# EAGLE board sc (EAGLE 7.7.0)
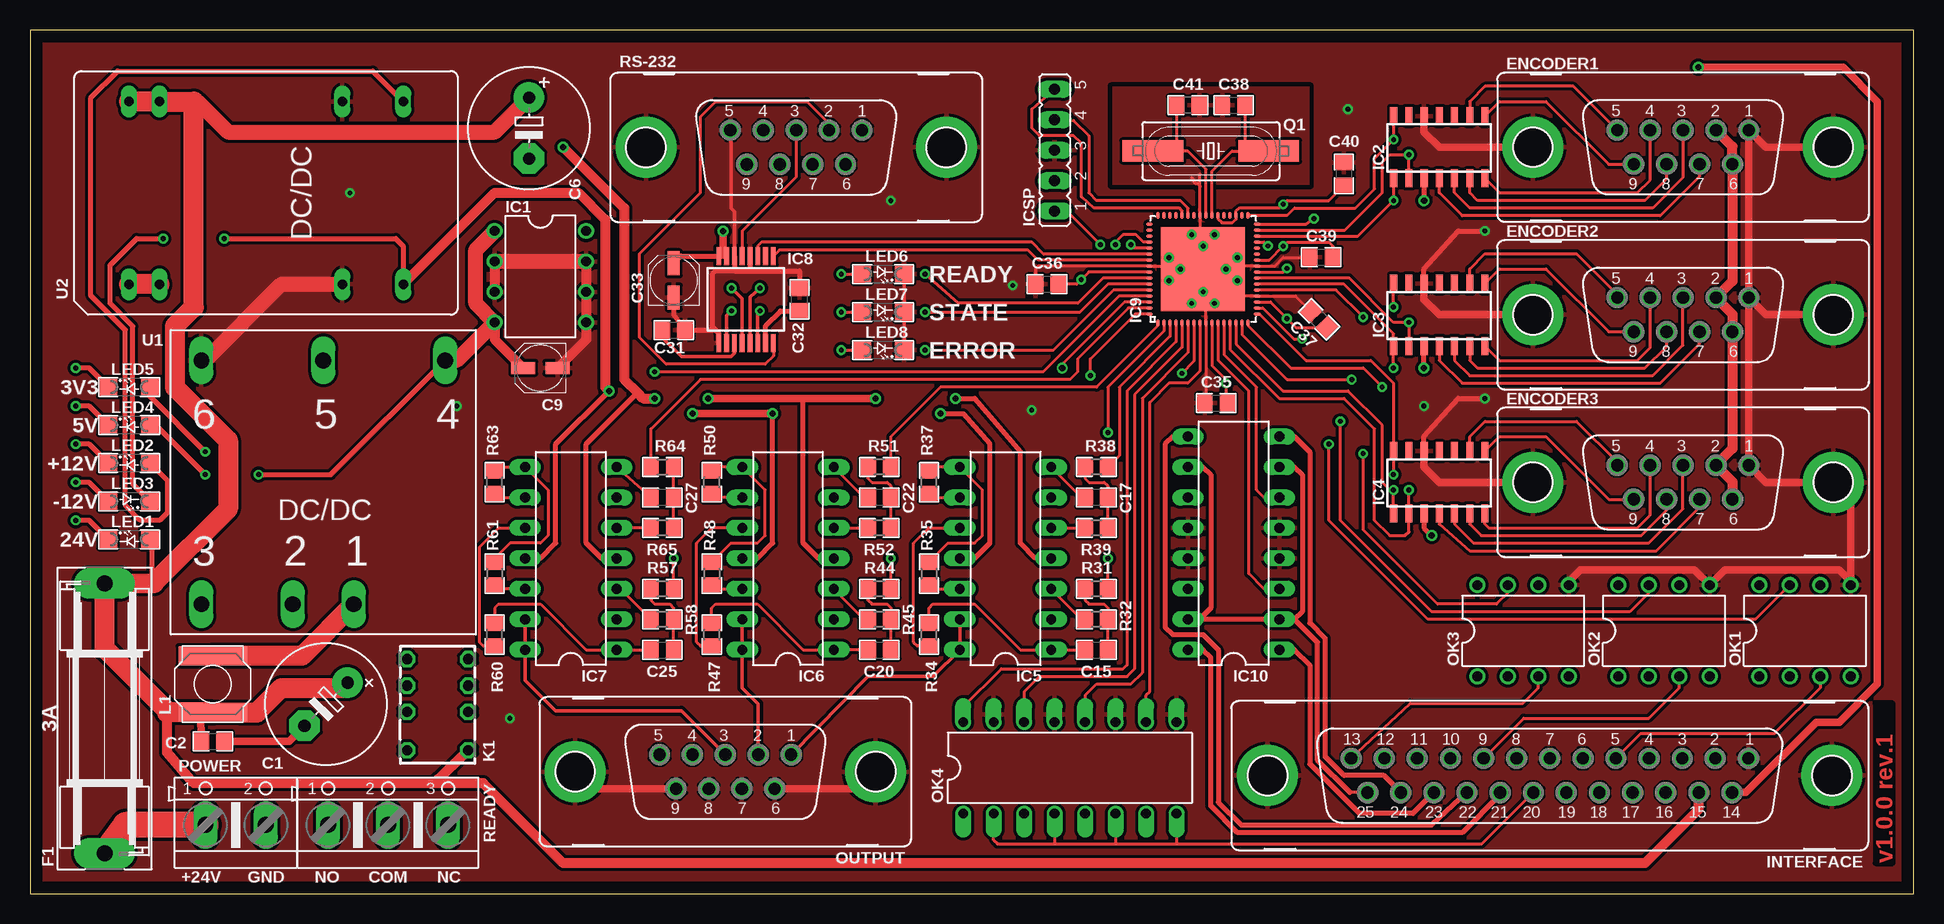
[diagram p7: board, top side]
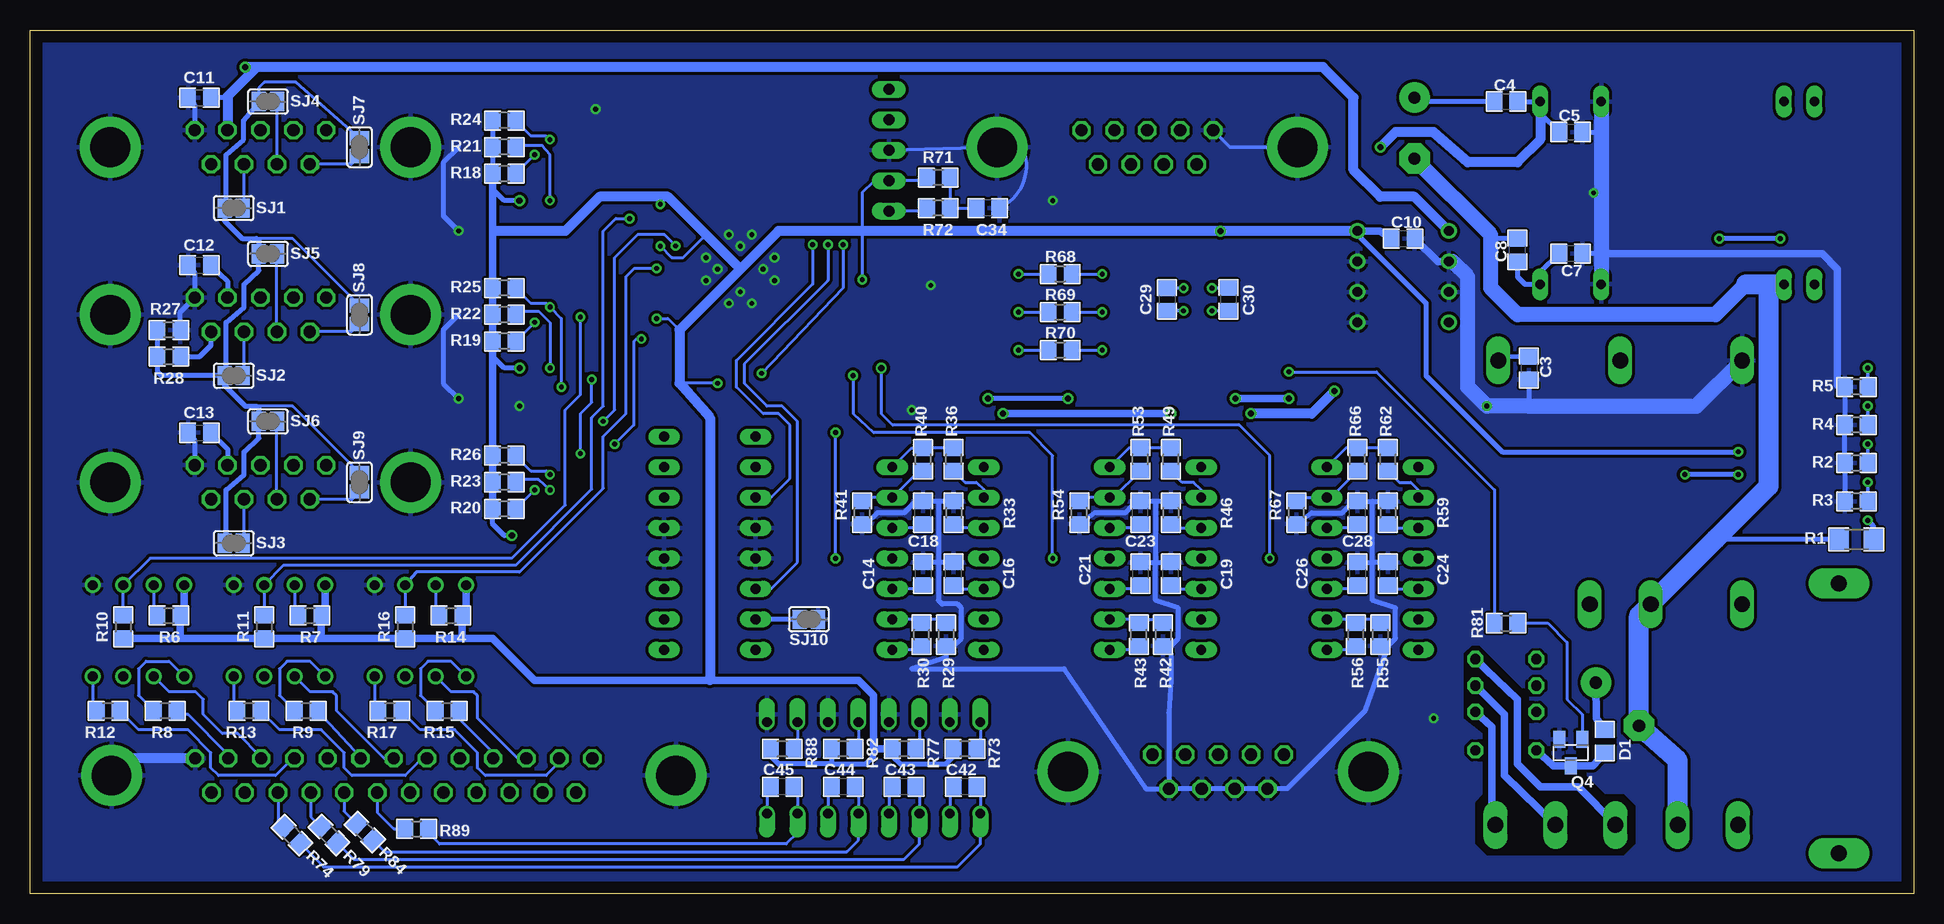
[diagram p8: board, bottom side, seen from below]

Size 157 x 72 mm. Coordinates in mm from the lower left corner, seen from the top.
Outline: 0,0 157,0 157,72 0,72 0,0
Copper layers (1*16): Top 0.035mm / dielectric 1.5mm / Bottom 0.035mm
Design rules "default *": minimum track width 0.15mm, minimum drill 0.4mm, track to track 0.2mm, track to pad 0.2mm, pad to pad 0.2mm, via to via 0.2mm, smd to smd 0.2mm, copper to edge 40mil, drill to drill 8mil, minimum pad ring 10mil, minimum via ring 8mil, stop-mask expansion 4mil, vias tented up to drill 0mil, thermal gap 10mil
Net classes: 0 default: clearance 0.205 mm
tKeepout: area 0,0 to 2,72; area 155,0 to 157,72; area 0,70 to 157,72; area 0,0 to 157,2

## Footprints (pad centres in the part's own frame; a part is rotated, then mirrored left to right if it is on the bottom)
E5-10,5 = drill 1.016 pad 2.54: + -2.54,0 | drill 1.016 pad 2.54 octagon: - 2.54,0
C0805 = smd 1.3 x 1.5: 1 -0.95,0; 2 0.95,0
UD-4X5,8_NICHICON = smd 2 x 1: + 1.425,0; - -1.425,0
D0805 = smd 1.3 x 1.5: 1 -0.95,0; 2 0.95,0
F09VP = drill 1.016 octagon: 1 5.486,1.422; 2 2.743,1.422; 3 0,1.422; 4 -2.743,1.422; 5 -5.486,1.422; 6 4.115,-1.422; 7 1.372,-1.422; 8 -1.372,-1.422; 9 -4.115,-1.422 | drill 3.302 pad 5.08: G1 -12.522,0; G2 12.522,0
SH22,5 = drill 1.321 pad 2.54 long: 1 -11.252,0; 2 11.252,0
DIL08 = drill 0.813 pad 1.27: 1 -3.81,-3.81; 2 -1.27,-3.81; 3 1.27,-3.81; 4 3.81,-3.81; 5 3.81,3.81; 6 1.27,3.81; 7 -1.27,3.81; 8 -3.81,3.81
SO14 = smd 0.6 x 1.5: 1 -3.81,-2.6; 2 -2.54,-2.6; 3 -1.27,-2.6; 4 0,-2.6; 5 1.27,-2.6; 6 2.54,-2.6; 7 3.81,-2.6; 8 3.81,2.6; 9 2.54,2.6; 10 1.27,2.6; 11 0,2.6; 12 -1.27,2.6; 13 -2.54,2.6; 14 -3.81,2.6
DIL14 = drill 0.813 long: 1 -7.62,-3.81; 2 -5.08,-3.81; 3 -2.54,-3.81; 4 0,-3.81; 5 2.54,-3.81; 6 5.08,-3.81; 7 7.62,-3.81; 8 7.62,3.81; 9 5.08,3.81; 10 2.54,3.81; 11 0,3.81; 12 -2.54,3.81; 13 -5.08,3.81; 14 -7.62,3.81
SSOP16 = smd 0.4 x 1.5: 1 -2.275,-3.625; 2 -1.625,-3.625; 3 -0.975,-3.625; 4 -0.325,-3.625; 5 0.325,-3.625; 6 0.975,-3.625; 7 1.625,-3.625; 8 2.275,-3.625; 9 2.275,3.625; 10 1.625,3.625; 11 0.975,3.625; 12 0.325,3.625; 13 -0.325,3.625; 14 -0.975,3.625; 15 -1.625,3.625; 16 -2.275,3.625
QFN64-9X9 = smd 0.55 x 0.28: 1 -4.477,3.75; 2 -4.477,3.25; 3 -4.477,2.75; 4 -4.477,2.25; 5 -4.477,1.75; 6 -4.477,1.25; 7 -4.477,0.75; 8 -4.477,0.25; 9 -4.477,-0.25; 10 -4.477,-0.75; 11 -4.477,-1.25; 12 -4.477,-1.75; 13 -4.477,-2.25; 14 -4.477,-2.75; 15 -4.477,-3.25; 16 -4.477,-3.75; 33 4.477,-3.75; 34 4.477,-3.25; 35 4.477,-2.75; 36 4.477,-2.25; 37 4.477,-1.75; 38 4.477,-1.25; 39 4.477,-0.75; 40 4.477,-0.25; 41 4.477,0.25; 42 4.477,0.75; 43 4.477,1.25; 44 4.477,1.75; 45 4.477,2.25; 46 4.477,2.75; 47 4.477,3.25; 48 4.477,3.75 | smd 0.28 x 0.55: 17 -3.75,-4.477; 18 -3.25,-4.477; 19 -2.75,-4.477; 20 -2.25,-4.477; 21 -1.75,-4.477; 22 -1.25,-4.477; 23 -0.75,-4.477; 24 -0.25,-4.477; 25 0.25,-4.477; 26 0.75,-4.477; 27 1.25,-4.477; 28 1.75,-4.477; 29 2.25,-4.477; 30 2.75,-4.477; 31 3.25,-4.477; 32 3.75,-4.477; 49 3.75,4.477; 50 3.25,4.477; 51 2.75,4.477; 52 2.25,4.477; 53 1.75,4.477; 54 1.25,4.477; 55 0.75,4.477; 56 0.25,4.477; 57 -0.25,4.477; 58 -0.75,4.477; 59 -1.25,4.477; 60 -1.75,4.477; 61 -2.25,4.477; 62 -2.75,4.477; 63 -3.25,4.477; 64 -3.75,4.477 | smd 7 x 7: EXP 0,0
DIL16 = drill 0.813 long: 1 -8.89,-3.81; 2 -6.35,-3.81; 3 -3.81,-3.81; 4 -1.27,-3.81; 5 1.27,-3.81; 6 3.81,-3.81; 7 6.35,-3.81; 8 8.89,-3.81; 9 8.89,3.81; 10 6.35,3.81; 11 3.81,3.81; 12 1.27,3.81; 13 -1.27,3.81; 14 -3.81,3.81; 15 -6.35,3.81; 16 -8.89,3.81
JP5 = drill 0.914 long: 1 -3.81,0; 2 -1.27,0; 3 1.27,0; 4 3.81,0; 5 6.35,0
F25VP = drill 1.016 octagon: 1 16.561,1.422; 2 13.792,1.422; 3 11.049,1.422; 4 8.28,1.422; 5 5.512,1.422; 6 2.769,1.422; 7 0,1.422; 8 -2.769,1.422; 9 -5.512,1.422; 10 -8.28,1.422; 11 -11.049,1.422; 12 -13.792,1.422; 13 -16.561,1.422; 14 15.189,-1.422; 15 12.421,-1.422; 16 9.652,-1.422; 17 6.909,-1.422; 18 4.14,-1.422; 19 1.372,-1.422; 20 -1.372,-1.422; 21 -4.14,-1.422; 22 -6.909,-1.422; 23 -9.652,-1.422; 24 -12.421,-1.422; 25 -15.189,-1.422 | drill 3.302 pad 5.08: G1 -23.52,0; G2 23.52,0
G6K-2P-Y = drill 0.85 octagon: 1 0,-2.54; 2 3.2,-2.54; 3 5.4,-2.54; 4 7.6,-2.54; 5 7.6,2.54; 6 5.4,2.54; 7 3.2,2.54; 8 0,2.54
DJNR6028 = smd 1.6 x 5.69: A -2.362,0; B 2.362,0
SML1206 = smd 1.5 x 1.5: A 1.75,0; C -1.75,0
DIL16' = drill 0.813 offset: 1 -8.89,-3.81; 2 -6.35,-3.81; 3 -3.81,-3.81; 4 -1.27,-3.81; 5 1.27,-3.81; 6 3.81,-3.81; 7 6.35,-3.81; 8 8.89,-3.81; 9 8.89,3.81; 10 6.35,3.81; 11 3.81,3.81; 12 1.27,3.81; 13 -1.27,3.81; 14 -3.81,3.81; 15 -6.35,3.81; 16 -8.89,3.81
AK500/2 = drill 1.321 long: 1 -2.515,0; 2 2.515,0
SM49 = smd 5.08 x 1.778: 1 -4.826,0; 2 4.826,0
SOT23 = smd 1 x 1.4: 1 -0.95,-1.1; 2 0.95,-1.1; 3 0,1.1
R1206 = smd 1.6 x 1.803: 1 -1.422,0; 2 1.422,0
R0805 = smd 1.3 x 1.5: 1 -0.95,0; 2 0.95,0
AK500/3 = drill 1.321 long: 1 -5.004,0; 2 0,0; 3 5.004,0
SJ = smd 1.168 x 1.6: 1 -0.762,0; 2 0.762,0
AM10CW-NZ = drill 1.321 long: 1 2.54,-10.16; 2 -2.54,-10.16; 3 -10.16,-10.16; 4 10.16,10.16; 5 0,10.16; 6 -10.16,10.16
TEN3-WIN = drill 0.813 long: 2 -7.62,11.43; 3 -7.62,8.89; 9 -7.62,-6.35; 11 -7.62,-11.43; 14 7.62,-11.43; 16 7.62,-6.35; 22 7.62,8.89; 23 7.62,11.43

## Placement (x,y rotation side)
C1  330uF  [E5-10,5]  24.67,15.78 225 top
C2  1uF  [C0805]  15.24,12.7 0 top
C3  10uF  [C0805]  32.07,43.81 270 bottom
C4  1nF/2KV  [C0805]  33.97,66.04 0 bottom
C5  470uF  [C0805]  28.57,63.5 0 bottom
C6  200uF  [E5-10,5]  41.59,63.82 270 top
C7  470uF  [C0805]  28.57,53.34 180 bottom
C8  1nF/2KV  [C0805]  33.02,53.66 90 bottom
C9  10uF  [UD-4X5,8_NICHICON]  42.55,43.81 180 top
C10  10uF  [C0805]  42.55,54.61 0 bottom
C11  10uF  [C0805]  142.88,66.36 0 bottom
C12  10uF  [C0805]  142.88,52.39 0 bottom
C13  10uF  [C0805]  142.88,38.42 0 bottom
C14  33n  [C0805]  82.55,26.67 270 bottom
C15  10n  [C0805]  88.9,20.32 0 top
C16  33n  [C0805]  80.01,26.67 90 bottom
C17  10n  [C0805]  88.9,33.02 180 top
C18  33n  [C0805]  82.55,31.75 90 bottom
C19  33n  [C0805]  64.45,26.67 270 bottom
C20  10n  [C0805]  70.8,20.32 0 top
C21  33n  [C0805]  61.91,26.67 90 bottom
C22  10n  [C0805]  70.8,33.02 180 top
C23  33n  [C0805]  64.45,31.75 90 bottom
C24  33n  [C0805]  46.35,26.67 270 bottom
C25  10n  [C0805]  52.7,20.32 0 top
C26  33n  [C0805]  43.81,26.67 90 bottom
C27  10n  [C0805]  52.7,33.02 180 top
C28  33n  [C0805]  46.35,31.75 90 bottom
C29  100n  [C0805]  62.23,49.53 270 bottom
C30  100n  [C0805]  57.09,49.54 90 bottom
C31  100n  [C0805]  53.66,46.99 0 top
C32  100n  [C0805]  64.14,49.53 90 top
C33  100n  [UD-4X5,8_NICHICON]  53.66,51.12 90 top
C34  100n  [C0805]  77.15,57.15 180 bottom
C35  100n  [C0805]  98.87,40.89 0 top
C36  100n  [C0805]  84.77,50.8 0 top
C37  100n  [C0805]  107.44,47.88 135 top
C38  27p  [C0805]  100.33,65.72 0 top
C39  100n  [C0805]  107.63,53.07 0 top
C40  100n  [C0805]  109.54,60.01 90 top
C41  27p  [C0805]  96.52,65.72 180 top
C42  100n  [C0805]  79.05,8.89 180 bottom
C43  100n  [C0805]  84.14,8.89 180 bottom
C44  100n  [C0805]  89.21,8.89 180 bottom
C45  100n  [C0805]  94.3,8.89 180 bottom
D1  1N4148SMD-0805  [D0805]  25.72,12.7 90 bottom
ENCODER1  [F09VP]  137.79,62.23 0 top
ENCODER2  [F09VP]  137.79,48.26 0 top
ENCODER3  [F09VP]  137.79,34.29 0 top
F1  3A  [SH22,5]  6.22,14.61 90 top
IC1  MAX604  [DIL08]  42.55,51.44 270 top
IC2  LM339D  [SO14]  117.47,62.23 0 top
IC3  LM339D  [SO14]  117.47,48.26 0 top
IC4  LM339D  [SO14]  117.47,34.29 0 top
IC5  LM324N  [DIL14]  81.31,27.94 90 top
IC6  LM324N  [DIL14]  63.18,27.94 90 top
IC7  LM324N  [DIL14]  45.09,27.94 90 top
IC8  MAX3221CAE  [SSOP16]  59.69,49.53 0 top
IC9  PIC32  [QFN64-9X9]  97.79,52.07 90 top
IC10  ULN2074BN  [DIL16]  100.33,29.21 90 top
ICSP  ICSP  [JP5]  85.41,60.71 90 top
INTERFACE  [F25VP]  126.68,9.84 0 top
K1  G6K-2P-Y  [G6K-2P-Y]  33.97,11.94 90 top
L1  4,7uH  [DJNR6028]  15.24,17.46 90 top
LED1  LED 24V  [SML1206]  8.26,29.53 0 top
LED2  LED +12V  [SML1206]  8.26,35.88 0 top
LED3  LED -12V  [SML1206]  8.26,32.7 180 top
LED4  LED 5V  [SML1206]  8.26,39.05 0 top
LED5  LED 3V3  [SML1206]  8.26,42.23 0 top
LED6  LED READY  [SML1206]  71.12,51.66 180 top
LED7  LED STATE  [SML1206]  71.12,48.48 180 top
LED8  LED ERROR  [SML1206]  71.12,45.31 180 top
OK1  TLP2662F  [DIL08]  147.95,21.91 0 top
OK2  TLP2662F  [DIL08]  136.2,21.91 0 top
OK3  TLP2662F  [DIL08]  124.46,21.91 0 top
OK4  LTV844  [DIL16']  86.67,10.48 0 top
OUTPUT  [F09VP]  57.96,10.16 0 top
POWER  12/24V_CON  [AK500/2]  17.14,5.71 0 top
Q1  20MHz 18pF  [SM49]  98.42,61.91 0 top
Q4  BC848SMD  [SOT23]  28.57,11.75 180 bottom
R1  2K2  [R1206]  4.76,29.53 180 bottom
R2  470  [R0805]  4.76,35.88 180 bottom
R3  470  [R0805]  4.76,32.7 180 bottom
R4  130  [R0805]  4.76,39.05 180 bottom
R5  100  [R0805]  4.76,42.23 180 bottom
R6  4K7  [R0805]  145.41,23.18 0 bottom
R7  4K7  [R0805]  133.66,23.18 0 bottom
R8  470  [R0805]  145.73,15.24 180 bottom
R9  470  [R0805]  133.98,15.24 180 bottom
R10  4K7  [R0805]  149.22,22.23 270 bottom
R11  4K7  [R0805]  137.47,22.23 270 bottom
R12  470  [R0805]  150.49,15.24 180 bottom
R13  470  [R0805]  138.74,15.24 180 bottom
R14  4K7  [R0805]  121.92,23.18 0 bottom
R15  470  [R0805]  122.23,15.24 180 bottom
R16  4K7  [R0805]  125.73,22.23 270 bottom
R17  470  [R0805]  127,15.24 180 bottom
R18  4K7  [R0805]  117.47,60.01 180 bottom
R19  4K7  [R0805]  117.47,46.04 180 bottom
R20  4K7  [R0805]  117.47,32.07 180 bottom
R21  4K7  [R0805]  117.47,62.23 180 bottom
R22  4K7  [R0805]  117.47,48.26 180 bottom
R23  4K7  [R0805]  117.47,34.29 180 bottom
R24  4K7  [R0805]  117.47,64.45 180 bottom
R25  4K7  [R0805]  117.47,50.48 180 bottom
R26  4K7  [R0805]  117.47,36.51 180 bottom
R27  330  [R0805]  145.41,44.77 0 bottom
R28  1K  [R0805]  145.41,46.99 180 bottom
R29  47K  [R0805]  80.64,21.59 270 bottom
R30  22K  [R0805]  82.68,21.59 90 bottom
R31  22K  [R0805]  88.9,25.4 180 top
R32  10K  [R0805]  88.9,22.86 180 top
R33  47K  [R0805]  80.01,31.75 270 bottom
R34  22K  [R0805]  74.93,21.59 90 top
R35  22K  [R0805]  74.93,26.67 270 top
R36  22K  [R0805]  80.01,36.2 90 bottom
R37  47K  [R0805]  74.93,34.29 90 top
R38  22K  [R0805]  88.9,35.56 180 top
R39  10K  [R0805]  88.9,30.48 180 top
R40  22K  [R0805]  82.55,36.2 90 bottom
R41  47K  [R0805]  87.63,31.75 90 bottom
R42  47K  [R0805]  62.55,21.59 270 bottom
R43  22K  [R0805]  64.58,21.59 90 bottom
R44  22K  [R0805]  70.8,25.4 180 top
R45  10K  [R0805]  70.8,22.86 180 top
R46  47K  [R0805]  61.91,31.75 270 bottom
R47  22K  [R0805]  56.83,21.59 90 top
R48  22K  [R0805]  56.83,26.67 270 top
R49  22K  [R0805]  61.91,36.2 90 bottom
R50  47K  [R0805]  56.83,34.29 90 top
R51  22K  [R0805]  70.8,35.56 180 top
R52  10K  [R0805]  70.8,30.48 180 top
R53  22K  [R0805]  64.45,36.2 90 bottom
R54  47K  [R0805]  69.53,31.75 90 bottom
R55  47K  [R0805]  44.45,21.59 270 bottom
R56  22K  [R0805]  46.48,21.59 90 bottom
R57  22K  [R0805]  52.7,25.4 180 top
R58  10K  [R0805]  52.7,22.86 180 top
R59  47K  [R0805]  43.81,31.75 270 bottom
R60  22K  [R0805]  38.73,21.59 90 top
R61  22K  [R0805]  38.73,26.67 270 top
R62  22K  [R0805]  43.81,36.2 90 bottom
R63  47K  [R0805]  38.73,34.29 90 top
R64  22K  [R0805]  52.7,35.56 0 top
R65  10K  [R0805]  52.7,30.48 180 top
R66  22K  [R0805]  46.35,36.2 90 bottom
R67  47K  [R0805]  51.44,31.75 90 bottom
R68  100  [R0805]  71.12,51.66 0 bottom
R69  100  [R0805]  71.12,48.48 0 bottom
R70  100  [R0805]  71.12,45.31 0 bottom
R71  10K  [R0805]  81.28,59.69 180 bottom
R72  1K  [R0805]  81.28,57.15 180 bottom
R73  4K7  [R0805]  79.06,12.06 180 bottom
R74  1K  [R0805]  135.16,4.86 315 bottom
R77  4K7  [R0805]  84.13,12.06 180 bottom
R79  1K  [R0805]  132.08,4.89 315 bottom
R81  4K7  [R0805]  33.97,22.54 0 bottom
R82  4K7  [R0805]  89.22,12.06 180 bottom
R84  1K  [R0805]  129.09,5.13 315 bottom
R88  4K7  [R0805]  94.29,12.06 180 bottom
R89  1K  [R0805]  124.77,5.4 0 bottom
READY  READY  [AK500/3]  29.84,5.71 0 top
RS-232  [F09VP]  63.87,62.22 0 top
SJ1  [SJ]  140.01,57.15 0 bottom
SJ2  [SJ]  140.01,43.18 0 bottom
SJ3  [SJ]  140.01,29.21 0 bottom
SJ4  [SJ]  137.16,66.04 0 bottom
SJ5  [SJ]  137.16,53.34 0 bottom
SJ6  [SJ]  137.16,39.37 0 bottom
SJ7  [SJ]  129.54,62.23 270 bottom
SJ8  [SJ]  129.54,48.26 270 bottom
SJ9  [SJ]  129.54,34.29 270 bottom
SJ10  [SJ]  92.08,22.86 180 bottom
U1  AM10CW-2405S-NZ  [AM10CW-NZ]  24.45,34.29 0 top
U2  TEN3-2422WIN  [TEN3-WIN]  19.68,58.42 90 top

## Tracks (layer width: path | path; a pad name or v marks a point on that pad's centre or on a via)
2V5
  Bottom 0.254: SJ7.1 134.81,67.63 137.47,67.63 137.92,67.18 SJ4.1 | SJ8.1 135.12,54.61 138.11,54.61 137.92,54.48 | SJ9.1 135.12,40.64 138.11,40.64 137.92,40.51
  Bottom 0.406: SJ4.1 137.92,65.91 139.19,64.45 139.19,62.87 140.65,61.59 140.65,57.28 SJ1.1 140.78,56.07 139.31,54.61 138.11,54.61 | 137.92,54.48 SJ5.1 137.92,51.94 139.16,50.8 139.16,48.9 140.65,47.62 140.65,43.31 SJ2.1 | 137.92,40.51 SJ6.1 137.92,37.97 139.16,36.83 139.16,34.92 140.65,33.66 140.65,29.34 SJ3.1 | R28.2 R27.1 146.36,43.49 146.05,43.18 SJ2.1 | SJ2.1 140.78,42.35 139.06,40.64 138.11,40.64
3V3  (via drill 0.41, 0.51)
  Top 0.254: IC9.19 103.4,49.32 v104.78,47.94 105.51,47.21 C37.1 | IC9.10 98.54,44.02 99.69,42.86 v99.69,42.55 99.69,41.52 C35.2 | IC9.26 103.3,52.82 v104.46,53.98 104.78,54.29 108.27,54.29 108.58,53.98 C39.2 | 99.06,56.57 IC9.38 99.04,56.22 99.34,55.94 100.23,55.94 100.54,56.22 IC9.35 100.54,56.9 100.86,57.17 104.17,57.17 v104.46,57.47 104.78,57.78 108.27,57.78 C40.1 | IC9.57 88.27,51.82 v87.63,51.19 87.25,50.8 C36.2
  Top 0.305: 57.78,53.34 57.41,53.66 IC8.16
  Top 0.406: IC8.15 IC8.16 54.27,53.16 C33.+ | v116.2,43.81 IC3.3 | LED5.A 10.01,41.43 v14.61,36.83 | IC2.3 v116.2,57.78 | IC4.3 116.2,30.48 v116.84,29.84
  Top 0.61: v57.78,55.24 57.78,53.34 | IC2.3
  Bottom 0.254: v87.63,51.19 87.63,55.24 87.63,58.42 86.61,59.44 ICSP.2 82.48,59.44 R71.2 | v104.46,53.98 103.5,53.02 102.55,53.02 100.65,54.93 | v99.69,42.55 102.87,42.55 | v104.78,47.94 103.82,47.94 102.87,46.99 | v104.46,57.47 103.82,58.1
  Bottom 0.406: R24.2 R21.2 R18.2 | v116.84,29.84 117.47,29.84 118.42,30.8 R20.2 | v116.2,43.81 117.47,43.81 118.42,44.77 R19.2 | 90.17,10.79 94.61,10.79 95.24,11.43 R88.2 | R77.2 85.08,11.43 84.45,10.79 80.64,10.79 80.01,11.43 R73.2 | 144.14,23.5 R6.2 144.14,22.86 | 132.39,23.5 R7.2 | R14.2 | IC1.8 46.35,54.93 40.64,49.21 40.64,43.18 34.29,36.83 v14.61,36.83 | v116.2,57.78 117.47,57.78 118.42,58.73 | 118.11,55.24 118.42,55.24 | R82.2 90.17,10.79 | 90.17,10.79 87.31,10.79 86.68,11.43 86.68,12.06
  Bottom 0.61: R77.2 86.68,12.06 86.68,16.51 87.95,17.78 100.33,17.78 114.94,17.78 118.43,21.27 120.97,21.27 | IC1.8 44.5,55.24 C10.1 | R20.2 R23.2 R26.2 R19.2 R22.2 R25.2 118.42,55.24 118.42,58.73 R18.2 | OK1.8 144.14,23.5 | OK2.8 132.39,23.5 | OK3.8 120.65,23.5 | 120.65,23.5 R14.2 | 144.46,21.27 R11.2 132.71,21.27 | 144.46,21.27 R10.2 | 132.71,21.27 R16.2 120.97,21.27 | R6.2 144.46,21.27 | R7.2 132.71,21.27 | 120.65,23.5 arc-90 R14.2 120.97,21.27
  Bottom 0.813: IC1.8 v57.78,55.24 87.63,55.24 94.61,55.24 97.79,52.07 | 97.79,52.07 102.87,46.99 102.87,42.55 100.33,39.69 100.33,17.78 | 97.79,52.07 100.65,54.93 103.82,58.1 109.54,58.1 112.39,55.24 118.11,55.24
5V  (via drill 0.41, 0.51)
  Top 0.406: LED4.A 10.48,39.05 v14.61,34.92 | v19.05,34.92 25.08,34.92 U1.4
  Top 0.61: v139.06,68.9 151.13,68.9 153.99,66.04 153.99,17.46 150.81,14.29 148.91,14.29 143.04,8.42 INTERFACE.14
  Top 0.813: IC1.4 38.73,46.2 C9.+ | ENCODER1.2 141.91,62.28 ENCODER1.6 141.91,51.05 ENCODER2.2 141.91,48.31 ENCODER2.6 141.91,37.08 ENCODER3.2 141.91,34.34 ENCODER3.6
  Top 1.27: IC1.1 37.15,53.66 37.15,49.21 IC1.4 35.56,44.45 U1.4
  Bottom 0.406: R27.2 142.86,44.77 141.91,45.72 ENCODER2.6 | U1.4 34.24,44.81 C3.1 | v14.61,34.92 v19.05,34.92 | 140.53,66.48 140.65,66.36 C11.2 | C12.2 140.53,51.05 ENCODER2.2 | C13.2 140.53,37.08 ENCODER3.2
  Bottom 0.813: IC1.1 41.59,58.1 44.45,58.1 46.67,60.33 46.67,66.36 49.21,68.9 138.11,68.9 | 138.11,68.9 140.53,66.48 ENCODER1.2 | 138.11,68.9 v139.06,68.9
24V
  Top 2.184: POWER.1 7.96,5.71 F1.1
24V_F
  Top 0.406: 10.16,29.38 10.16,25.88
  Top 0.61: C2.1 14.24,15.05 L1.A | LED1.A 10.16,29.38
  Top 0.813: K1.1 33.66,9.21 | 33.66,9.21 13.65,9.21 11.43,11.75 11.43,15.23 | 33.66,9.21 37.78,9.21 44.45,2.54 134.62,2.54 139.1,7.02 INTERFACE.15
  Top 1.27: L1.A 17.64,15.1 | 13.65,66.04 13.97,66.04 16.51,63.5 38.73,63.5 C6.+
  Top 1.676: U2.23 U2.22 13.65,66.04 13.65,48.9 12.06,47.31 12.06,42.23 16.51,37.78 16.51,32.07 10.32,25.88 10.16,25.88 F1.2 6.22,20.44 11.43,15.23 11.43,15.1 L1.A | 17.64,15.1 18.91,15.1 20.95,17.14 26.04,17.14 C1.+
  Bottom 0.406: C4.1 41.27,66.04 C6.+
  Bottom 0.61: D1.2 26.46,14.61 C1.+
24VGND
  Top 0.61: C2.2 21.59,12.7 C1.-
  Top 1.676: U2.3 U2.2
  Bottom 0.406: U1.2 21.59,24.13 19.05,26.67 | C8.2 33.07,54.61 35.24,54.61 | R1.2 16.51,29.53
  Bottom 1.27: U2.3 11.43,50.8 arc-90 12.06,50.16 | 13.97,50.8 16.51,48.26 33.02,48.26 35.24,50.48 35.24,54.61 35.24,54.93 C6.-
  Bottom 1.676: POWER.2 19.66,11.09 C1.- 22.88,23.16 U1.2 16.51,29.53 12.06,33.97 12.06,50.16 | 13.97,50.8 11.43,50.8
!MCLR  (via drill 0.41)
  Top 0.254: IC9.7 97.04,44.4 v96.01,43.37 | v89.22,54.1 86.42,56.9 ICSP.1
  Bottom 0.254: v89.22,54.1 89.22,50.48 v96.01,43.37 | R72.2 82.48,56.9 ICSP.1
+12V  (via drill 0.51)
  Top 0.406: U2.14 28.57,68.58 7.3,68.58 5.08,66.36 5.08,49.85 7.94,46.99 7.94,32.38 9.21,31.11 10.79,31.11 11.43,31.75 11.43,34.45 LED2.A | IC7.4 47.62,27.94 46.35,29.21 46.35,37.47 50.64,41.75 | IC6.4 65.72,27.94 64.45,29.21 64.45,41.27 | IC5.4 83.82,27.94 82.55,29.21 82.55,36.83 78.74,41.27 v77.15,41.27
  Top 0.61: v56.52,41.27 64.45,41.27 v70.48,41.27
  Top 0.813: v44.45,62.23 49.53,57.15 49.53,42.86 50.64,41.75 51.12,41.27 v52.07,41.27
  Bottom 0.406: C4.2 U2.14 31.11,65.04 C5.1 | v70.48,41.27 v77.15,41.27
  Bottom 0.61: v52.07,41.27 v56.52,41.27
  Bottom 0.813: U2.14 31.11,62.87 33.02,60.96 37.15,60.96 40.01,63.5 43.18,63.5 v44.45,62.23
-12V  (via drill 0.41, 0.51)
  Top 0.406: IC7.11 42.55,27.94 43.81,29.21 43.81,37.47 v48.26,41.91 | IC6.11 60.64,27.94 61.91,29.21 v61.91,40.01 | IC5.11 78.74,27.94 80.01,29.21 80.01,37.47 77.79,40.01 v75.88,40.01 | LED3.C 8.57,34.13 8.57,47.31 6.67,49.21 6.67,52.39 8.89,54.61 v11.11,54.61 | v16.19,54.61 30.48,54.61 31.11,53.98 U2.11
  Top 0.61: v55.24,40.01 v61.91,40.01
  Top 0.813: U2.11 38.73,58.42 45.72,58.42 47.94,56.2 47.94,42.23 v48.26,41.91
  Bottom 0.406: C8.1 33.02,51.44 32.38,50.8 U2.11 31.11,51.8 C7.2 | v11.11,54.61 v16.19,54.61
  Bottom 0.61: v61.91,40.01 v75.88,40.01
  Bottom 0.813: v55.24,40.01 50.16,40.01 v48.26,41.91
CH1_A+
  Top 0.254: ENCODER1.3 137.79,59.69 135.25,57.15 120.01,57.15 118.74,58.42 IC2.5
CH1_A-
  Top 0.254: ENCODER1.7 139.16,59.79 135.89,56.52 119.38,56.52 117.47,58.42 IC2.4
  Bottom 0.254: 139.16,57.24 ENCODER1.7
  Bottom 0.406: SJ1.2 139.16,57.24
CH1_B+
  Top 0.254: IC2.7 122.49,58.42 133.98,58.42 135.05,59.49 ENCODER1.4
CH1_B-
  Top 0.254: IC2.6 120.01,58.42 120.65,57.78 134.62,57.78 136.42,59.59 ENCODER1.8
  Bottom 0.254: 136.42,65.7 ENCODER1.8
  Bottom 0.406: SJ4.2 136.42,65.7
CH1_CMD
  Top 0.305: IC5.13 IC5.14 75.28,18.1 69.85,18.1 OUTPUT.1
CH1_DIR  (via drill 0.41)
  Top 0.254: IC9.21 108.87,50.32 v111.12,48.07
  Bottom 0.254: R10.1 OK1.6 147,27.94 116.84,27.94 112.39,32.38 112.39,40.32 111.12,41.59 v111.12,48.07
CH1_DIR_H
  Bottom 0.254: 135.1,11.27 136.52,9.84 141.28,9.84 141.92,10.48 141.92,11.75 143.82,13.65 147.95,13.65 R12.1
  Bottom 0.406: INTERFACE.4 135.1,11.27
CH1_DIR_L
  Top 0.254: OK1.3 149.22,17.14 145.41,13.34 134.26,13.34 INTERFACE.5
CH1_H  (via drill 0.41)
  Top 0.254: R31.1 v89.85,27.94 | IC9.2 94.54,46.91 89.85,42.23 v89.85,38.43
  Bottom 0.254: v89.85,27.94 v89.85,38.43
CH1_I+
  Top 0.254: ENCODER1.5 128.65,67.31 121.28,67.31 120.01,66.04 IC2.9
CH1_I-
  Top 0.254: IC2.8 122.49,66.04 126.36,66.04 131.59,60.81 ENCODER1.9
  Bottom 0.254: SJ7.2 130.2,60.81 ENCODER1.9
CH1_L
  Top 0.254: IC9.3 95.04,46.46 90.81,42.23 90.81,36.51 R38.1
CH1_QE_A  (via drill 0.41)
  Top 0.254: IC2.2 v114.94,61.59 113.35,61.59 112.71,60.96 112.71,58.42 109.61,55.32 IC9.31
  Top 0.406: IC2.2
  Bottom 0.254: v114.94,61.59 R18.1
CH1_QE_B  (via drill 0.41)
  Top 0.254: IC2.1 v113.67,57.78 110.7,54.82 IC9.30
  Bottom 0.254: v113.67,57.78 113.67,61.59 114.3,62.36 116.39,62.36
  Bottom 0.305: 116.39,62.36 R21.1
CH1_QE_I  (via drill 0.41)
  Top 0.254: IC2.14 113.67,63.18 v113.67,62.87 112.08,61.28 112.08,58.74 110.49,57.15 105.41,57.15 104.81,56.55 IC9.33
  Bottom 0.254: R24.1 115.25,63.18 113.98,63.18 v113.67,62.87
CH1_STEP  (via drill 0.41)
  Top 0.254: OK1.7 143.82,22.86 116.52,22.86 108.27,31.11 v108.27,37.47 | v106.05,46.24 105.34,46.24 102.77,48.82 IC9.18
  Bottom 0.254: OK1.7 146.68,23.5 | v106.05,46.24 106.48,46.24 106.68,46.04 106.68,39.05 v108.27,37.47
  Bottom 0.406: 146.68,23.5 R6.1
CH1_STEP_H
  Bottom 0.254: INTERFACE.2 140.47,11.57 143.82,14.92 144.46,14.92
  Bottom 0.406: 144.46,14.92 R8.1
CH1_STEP_L
  Bottom 0.254: OK1.2 145.41,16.83 143.19,16.83 142.55,16.19 142.55,14.92 140.97,13.34 139.7,13.34 137.73,11.37
  Bottom 0.406: INTERFACE.3 137.73,11.37
CH2_A+
  Top 0.254: IC3.5 118.74,44.45 120.01,43.18 135.25,43.18 137.79,45.72 ENCODER2.3
CH2_A-
  Top 0.254: IC3.4 117.47,44.45 119.38,42.55 135.89,42.55 139.16,45.82 ENCODER2.7
  Bottom 0.254: 139.16,43.27 ENCODER2.7
  Bottom 0.406: SJ2.2 139.16,43.27
CH2_B+
  Top 0.254: IC3.7 122.49,44.45 133.98,44.45 135.05,45.52 ENCODER2.4
CH2_B-
  Top 0.254: IC3.6 120.01,44.45 120.65,43.81 134.62,43.81 136.42,45.62 ENCODER2.8
  Bottom 0.254: ENCODER2.8 136.42,53.31
  Bottom 0.406: 136.42,53.31 SJ5.2
CH2_CMD
  Top 0.305: IC6.13 IC6.14 59.37,17.14 60.7,15.81 OUTPUT.2
CH2_DIR  (via drill 0.41)
  Top 0.254: IC9.32 106.42,55.82 v107.02,56.26
  Bottom 0.254: R11.1 OK2.6 135.89,27.37 116.52,27.37 110.17,33.72 110.17,39.69 109.22,40.64 109.22,55.24 108.18,56.29 v107.02,56.26
CH2_DIR_H
  Bottom 0.254: INTERFACE.8 124.3,11.27 125.73,9.84 130.17,9.84 130.81,10.48 130.81,11.75 132.71,13.65 136.21,13.65 R13.1
CH2_DIR_L
  Top 0.254: INTERFACE.9 124.51,14.61 134.93,14.61 137.47,17.14 OK2.3
CH2_H  (via drill 0.41)
  Top 0.254: R44.1 v71.75,27.94 | v88.39,43.18 88.39,44.58 92.14,48.32 IC9.64
  Bottom 0.254: v71.75,27.94 71.75,36.51 73.66,38.42 86.68,38.42 88.39,40.01 v88.39,43.18
CH2_I+
  Top 0.254: IC3.9 120.01,52.07 121.28,53.34 128.9,53.34 132.31,49.94 ENCODER2.5
CH2_I-
  Top 0.254: IC3.8 122.49,52.07 126.36,52.07 131.59,46.84 ENCODER2.9
  Bottom 0.254: SJ8.2 130.2,46.84 ENCODER2.9
CH2_L
  Top 0.254: R51.1 71.75,38.1 75.88,42.23 88.9,42.23 94.04,47.37 IC9.1
CH2_QE_A  (via drill 0.41)
  Top 0.254: IC3.2 v114.93,47.62 113.67,47.62 109.97,51.32 IC9.23
  Bottom 0.254: R19.1 v114.93,47.62
  Bottom 0.406: R19.1
CH2_QE_B  (via drill 0.41)
  Top 0.254: v113.66,43.81 IC3.1 | IC3.1 113.67,46.67 109.52,50.82 IC9.22
  Top 0.305: IC3.1
  Bottom 0.254: 116.14,48.51 114.55,48.51 113.66,47.62 v113.66,43.81
  Bottom 0.406: 116.14,48.51 R22.1
CH2_QE_I  (via drill 0.41)
  Top 0.254: v113.66,48.9 IC3.14 | IC9.16 101.54,47.37 105.09,43.81 111.12,43.81 v112.71,42.23
  Bottom 0.254: R25.1 115.25,49.21 113.98,49.21 v113.66,48.9 112.71,47.94 v112.71,42.23
CH2_STEP  (via drill 0.41)
  Top 0.254: OK2.7 134.93,25.08 133.35,23.5 116.84,23.5 109.22,31.11 v109.22,39.37 | IC9.29 102.87,54.32 v103.19,54
  Bottom 0.254: OK2.7 134.93,23.5 | v103.19,54 104.11,54.93 106.36,54.93 108.27,53.02 108.27,40.32 v109.22,39.37
  Bottom 0.406: 134.93,23.5 R7.1
CH2_STEP_H
  Bottom 0.254: INTERFACE.6 129.45,11.34 R9.1
CH2_STEP_L
  Bottom 0.254: INTERFACE.7 127.47,11.27 131.44,15.24 131.44,16.51 131.76,16.83 133.66,16.83 OK2.2
CH3_A+
  Top 0.254: IC4.5 118.74,30.8 120.33,29.21 134.93,29.21 137.79,32.07 ENCODER3.3
CH3_A-
  Top 0.254: IC4.4 117.47,30.8 120.01,28.57 135.57,28.57 139.16,32.17 ENCODER3.7
  Bottom 0.254: 139.16,29.3 ENCODER3.7
  Bottom 0.406: SJ3.2 139.16,29.3
CH3_B+
  Top 0.254: ENCODER3.4 135.05,31.55 133.98,30.48 121.6,30.48 121.28,30.8 IC4.7
CH3_B-
  Top 0.254: IC4.6 120.01,30.8 120.96,29.84 134.3,29.84 136.42,31.97 ENCODER3.8
  Bottom 0.254: ENCODER3.8 136.42,39.34
  Bottom 0.406: 136.42,39.34 SJ6.2
CH3_CMD
  Top 0.305: IC7.13 IC7.14 41.27,17.78 43.81,15.24 54.3,15.24 OUTPUT.3
CH3_DIR  (via drill 0.41)
  Top 0.254: IC9.24 104.47,51.82 v104.78,52.12
  Bottom 0.254: OK3.6 R16.1 | v104.78,52.12 106.63,52.12 107.31,51.44 107.31,40.01 109.22,38.1 109.22,33.78 116.2,26.8 124.77,26.8
  Bottom 0.305: 124.77,26.8 OK3.6
CH3_DIR_H
  Bottom 0.254: INTERFACE.12 112.89,10.94 113.98,9.84 119.06,9.84 119.69,10.48 119.69,11.75 121.6,13.65 124.46,13.65 R17.1
CH3_DIR_L
  Top 0.254: INTERFACE.13 115.05,15.88 124.46,15.88 125.73,17.14 OK3.3
CH3_H  (via drill 0.41, 0.51)
  Top 0.254: R57.1 v53.66,27.94 | IC9.62 91.23,49.32 86.04,44.13 v86.04,43.81
  Top 0.305: v53.66,27.94
  Bottom 0.254: v53.66,27.94 53.66,36.51 56.2,39.05 85.09,39.05 86.04,40.01 v86.04,43.81
CH3_I+
  Top 0.254: IC4.9 120.01,38.1 121.28,39.37 128.9,39.37 132.31,35.97 ENCODER3.5
CH3_I-
  Top 0.254: IC4.8 122.49,38.1 126.36,38.1 131.59,32.87 ENCODER3.9
  Bottom 0.254: 130.2,32.87 ENCODER3.9
  Bottom 0.305: SJ9.2 130.2,32.87
CH3_L
  Top 0.254: R64.1 51.76,38.74 55.88,42.86 86.68,42.86 87.31,43.5 87.31,44.58 91.56,48.82 IC9.63
CH3_QE_A  (via drill 0.41)
  Top 0.254: IC4.2 v114.93,33.66 | 114.62,29.84 113.35,29.84 112.08,31.11 112.08,38.73 109.54,41.27 104.14,41.27 100.04,45.38 IC9.13 | 114.94,30.16 IC4.2
  Top 0.305: 114.62,29.84 114.94,30.16 | IC4.2
  Bottom 0.254: v114.93,33.66 R20.1
CH3_QE_B  (via drill 0.41)
  Top 0.254: IC4.1 v113.66,33.66 | 113.35,33.66 112.71,34.29 112.71,39.05 109.86,41.91 104.46,41.91 100.54,45.83 IC9.14
  Top 0.305: v113.66,33.66 113.35,33.66
  Bottom 0.254: v113.66,33.66 114.61,34.52 116.2,34.52
  Bottom 0.406: 116.2,34.52 R23.1
CH3_QE_I  (via drill 0.41)
  Top 0.254: IC4.14 v113.66,34.92 | IC4.14 113.67,42.55 111.76,44.45 106.36,44.45 102.49,48.32 IC9.17
  Top 0.305: IC4.14
  Bottom 0.254: R26.1 115.25,35.24 113.98,35.24 v113.66,34.92
CH3_STEP  (via drill 0.41)
  Top 0.254: OK3.7 123.19,25.08 122.24,24.13 117.32,24.13 111.12,30.32 v111.12,36.67 | IC9.15 101.04,46.6 104.78,42.86 v110.17,42.86
  Bottom 0.254: OK3.7 123.19,23.5 | v111.12,36.67 111.12,40.01 110.17,40.96 v110.17,42.86
  Bottom 0.406: 123.19,23.5 R14.1
CH3_STEP_H
  Bottom 0.254: INTERFACE.10 118.4,11.72 121.28,14.61
  Bottom 0.406: 121.28,14.61 R15.1
CH3_STEP_L
  Bottom 0.254: INTERFACE.11 116.35,11.27 119.69,14.61 119.69,16.51 120.01,16.83 121.92,16.83 OK3.2
DI1
  Top 0.254: IC9.4 95.54,46.01 91.44,41.91 91.44,19.05 91.12,18.73 80.96,18.73 77.78,15.55 OK4.16
  Bottom 0.254: OK4.16 77.78,12.06 R73.1
DI1_CON
  Bottom 0.254: 136.13,5.83 R74.1 136.33,6.03 INTERFACE.16
DI2
  Top 0.254: IC9.5 96.04,45.56 92.08,41.59 92.08,18.73 91.44,18.1 84.14,18.1 82.86,16.82 OK4.14
  Bottom 0.254: OK4.14 82.86,12.06 R77.1
DI2_CON
  Bottom 0.254: R79.1 133.59,6.41 INTERFACE.17
DI3
  Top 0.254: IC9.6 96.54,45.1 92.71,41.27 92.71,18.41 91.76,17.46 88.9,17.46 87.94,16.51 OK4.12
  Bottom 0.254: OK4.12 87.94,12.06 R82.1
DI3_CON
  Bottom 0.254: R84.1 130.82,6.87 INTERFACE.18
DI4
  Top 0.254: IC9.8 97.54,43.56 96.52,42.55 94.93,42.55 93.34,40.96 93.34,16.83 93.02,16.51 OK4.10
  Bottom 0.254: OK4.10 93.02,12.06 R88.1
DI4_CON
  Bottom 0.254: R89.1 126.68,5.4 128.05,6.77 INTERFACE.19
DI_COM_CON
  Top 0.254: 85.4,4.13 80.64,4.13 80.33,4.45 80.32,4.45 OK4.2 | 85.4,4.13 90.48,4.13 | 90.48,4.13 95.57,4.13 | 95.57,4.13 95.56,4.45 OK4.8 | 95.57,4.13 121.02,4.13 INTERFACE.20 | OK4.4 85.4,4.13 | OK4.6 90.48,4.13
  Bottom 0.254: C43.2 85.4,8.89 OK4.4 | C45.2 95.56,8.89 OK4.8 | 90.48,8.57 OK4.6 | 80.32,8.57 OK4.2
  Bottom 0.406: 80.32,8.57 C42.2 | 90.48,8.57 C44.2
DO1  (via drill 0.41)
  Top 0.254: IC9.52 92.81,54.32 92.2,54.93 91.12,54.93 90.49,54.29 v90.49,54.1
  Bottom 0.254: v90.49,54.1 90.49,51.12 97.47,44.13 97.47,42.55 95.57,40.64 94.3,40.64 93.03,39.37 93.03,27.62 95.25,25.4 IC10.14
DO1_CON
  Top 0.254: INTERFACE.21 122.54,8.24
  Top 0.406: 122.54,8.24 119.38,5.08 100.65,5.08 98.42,7.3 98.42,19.68 97.79,20.32 IC10.16
DO1H_CON
  Bottom 0.61: K1.8 30.02,10.65 Q4.3 26.71,10.65 D1.1
DO2  (via drill 0.41)
  Top 0.254: IC9.53 91.91,53.82 v91.76,54.1
  Bottom 0.254: v91.76,54.1 91.76,50.8 98.11,44.45 98.11,42.23 95.89,40.01 94.61,40.01 93.66,39.05 93.66,34.61 95.25,33.02 IC10.11
DO2_CON
  Top 0.406: INTERFACE.22 116.84,5.71 100.97,5.71 99.06,7.62 99.06,20.32 97.79,21.59 95.25,21.59 94.61,22.23 94.61,37.47 95.25,38.1 IC10.9
DO3
  Top 0.254: IC9.11 99.04,44.47 101.6,41.91 101.6,26.67 102.87,25.4 IC10.3
DO3_CON
  Top 0.406: INTERFACE.23 115.27,6.67 110.81,6.67 106.68,10.79 106.68,19.05 105.41,20.32 IC10.1
DO4
  Top 0.254: IC9.12 99.54,44.92 102.23,42.23 102.23,33.66 102.87,33.02 IC10.6
DO4_CON
  Top 0.254: IC10.8 105.41,38.1
  Top 0.406: INTERFACE.24 112.84,9.84 109.54,9.84 107.95,11.43 107.95,21.27 106.68,22.54 106.68,36.83 105.41,38.1
DO_COM_CON
  Top 0.254: INTERFACE.25 110.01,8.42 | 97.47,22.86 IC10.15 | IC10.2 105.41,22.86
  Top 0.406: 110.01,8.42 107.31,11.11 107.31,20.95 105.41,22.86 106.05,23.5 106.05,34.92 105.41,35.56 IC10.7 | IC10.10 97.79,35.56 98.42,34.92 98.42,23.81 97.47,22.86 IC10.2
  Bottom 0.406: SJ10.2 IC10.15
GND  (via drill 0.41)
  Top 0.254: LED6.C LED7.C LED8.C | C39.1 106.63,53.02 104.46,53.02 103.75,52.32 IC9.25 99.94,52.32 v99.69,52.07 IC9.EXP v95.89,52.07 95.64,52.32 IC9.56 84.07,52.32 83.82,52.07 C36.1 | C35.1 98.04,41.01 IC9.9 98.04,49.91 v97.79,50.16 | 97.54,58.93 IC9.41 97.54,54.23 v97.79,53.98 | v97.79,50.16 97.41,50.16 | C37.2 105.5,49.82 IC9.20 98.14,49.82 v97.79,50.16 | 97.54,58.93 arc90 97.16,59.18 96.84,59.69 | 97.54,58.93 97.54,60.01
  Top 0.305: IC8.14 58.72,56.85 58.42,57.15 58.42,63.6 RS-232.5
  Top 0.406: IC8.14 58.72,51.91 | 58.72,51.91 60.02,51.91 | IC8.12 60.02,51.91 | 60.02,51.91 64.14,51.91 C32.2 | IC8.1 57.41,46.73 57.15,46.99 | 58.72,51.91 57.15,51.91 56.87,51.63 56.87,47.27 57.15,46.99 | C33.- 53.66,48.26 C31.2 57.15,46.99 | 41.55,52.98 IC1.7 | IC3.12 116.2,52.07 119.06,55.24 v121.28,55.24 | IC4.12 116.2,38.1 119.06,41.27 v121.28,41.27
  Top 0.61: IC2.12 116.2,63.5 117.47,62.23 ENCODER1.G1 | ENCODER1.G2 144.7,62.23 ENCODER1.1 ENCODER2.1 | ENCODER2.1 144.7,48.26 ENCODER2.G2 | ENCODER2.G1 117.47,48.26 116.2,49.53 IC3.12 | IC4.12 116.2,35.56 117.47,34.29 ENCODER3.G1 | ENCODER2.1 ENCODER3.1 144.7,34.29 ENCODER3.G2 151.76,32.84 OK1.5 151.76,26.04 150.81,26.99 141.28,26.99 OK2.5 138.74,26.99 129.22,26.99 128.27,26.03 OK3.5 | OUTPUT.6 69.06,8.74 OUTPUT.G2 | OUTPUT.9 46.86,8.74 OUTPUT.G1
  Top 0.813: C9.- 46.35,46.2 IC1.5 IC1.6 IC1.7 | IC1.2 IC1.3
  Top 1.27: IC1.7 IC1.2 | U2.9 20.95,50.8 14.61,44.45 U1.6
  Bottom 0.305: ICSP.3 RS-232.G2 74.29,62.22 arc90 C34.1 | RS-232.G1 56.96,62.22 RS-232.5
  Bottom 0.406: R5.2 R4.2 R2.2 R3.2 | R28.1 144.46,48.5 ENCODER2.1 143.28,51.79 C12.1 | 121.28,62.23 122.55,60.96 122.55,56.51 v121.28,55.24 | 121.28,48.26 122.55,46.99 122.55,42.54 v121.28,41.27 | 45.09,27.62 45.09,32.7 | C24.1 45.09,27.62 | C26.2 45.09,27.62 | 45.09,32.7 C28.2 46.67,32.7 47.62,31.75 50.17,31.75 R67.1 | 45.09,32.7 45.08,32.7 R59.1 | R55.2 43.81,20.64 | 43.81,20.64 43.18,21.27 43.18,23.81 45.09,24.45 45.09,27.62 | 43.81,20.64 45.72,15.24 52.22,8.74 OUTPUT.9 OUTPUT.8 OUTPUT.7 OUTPUT.6 | C19.1 63.18,27.62 | 63.18,27.62 C21.2 | 63.18,27.62 63.18,24.45 61.28,23.81 61.28,21.27 61.91,20.64 R42.2 61.91,20 61.91,17.78 62.08,15.09 OUTPUT.6 | R46.1 63.18,32.7 | 63.18,32.7 C23.2 64.77,32.38 65.09,32.38 65.72,31.75 68.26,31.75 R54.1 | 63.18,32.7 63.18,27.62 | R33.1 81.28,32.7 | 81.28,32.7 C18.2 83.19,32.7 84.14,31.75 86.36,31.75 87.31,30.8 R41.1 | C16.2 81.28,27.62 | 81.28,27.62 C14.1 | 81.28,27.62 81.28,24.45 80.96,24.13 79.69,24.13 79.38,23.81 79.38,21.27 80.01,20.64 R29.2 80.64,19.68 83.5,18.73 70.8,18.73 63.98,8.74 OUTPUT.6 | 81.28,32.7 81.28,27.62 | C3.2 32.07,40.64 | U2.9 26.04,51.8 | U2.16 26.04,65.04 | 26.04,53.34 C7.1 | C5.2 26.04,63.5 | C11.1 143.28,65.76 ENCODER1.1 | C13.1 143.28,37.82 ENCODER3.1
  Bottom 0.61: C10.2 39.64,52.7 IC1.2 | R5.2 6.35,42.39 6.35,52.07 7.62,53.34 26.04,53.34 | INTERFACE.G1 104.58,8.42
  Bottom 0.813: INTERFACE.1 148.4,11.27 INTERFACE.G2
  Bottom 1.27: U2.16 26.04,63.5 26.04,53.34 U2.9 | IC1.2 38.42,52.7 37.15,51.44 37.15,42.23 v35.56,40.64 32.07,40.64 18.1,40.64 U1.6
  other vias: 81.92,50.7 83.5,40.32 109.86,65.41 71.75,57.78 40.01,14.61 116.2,40.64 98.74,54.93 96.84,54.93 100.65,53.02 100.65,51.12 98.74,49.21 96.84,49.21 94.93,51.12 94.93,53.02 26.67,58.42
  pour Top (isolate 0.254, rank 2): -40.64,86.36 173.99,86.36 173.99,-7.62 -40.64,-7.62
  pour Bottom (isolate 0.254, rank 2): -8.89,86.36 207.01,85.09 207.01,-8.89 -8.89,-7.62
  cutout Top: 93.98,55.88 101.6,55.88 101.6,48.26 93.98,48.26
  cutout Top: 90.17,58.74 arc-90 89.85,59.05 89.85,67.31 arc-90 90.17,67.63 106.68,67.63 arc-90 107,67.31 107,59.05 arc-90 106.68,58.74 98.74,58.74 98.74,59.05 106.68,59.05 106.68,67.31 90.17,67.31 90.17,59.05 97.16,59.05 arc-90 97.54,58.74 97.47,57.15 97.16,57.15 97.16,58.42 arc90 96.84,58.74
  cutout Bottom (isolate 0.254): 32.07,16.51 36.2,20.64 36.83,20.64 37.47,20 37.47,14.61 35.88,13.34 35.88,8.26 36.51,7.62 36.51,4.13 35.56,3.17 24.13,3.17 23.18,4.13 23.18,7.3 24.13,8.26 25.72,8.26 27.3,9.84 30.48,9.84 32.07,11.43
LED_ERROR  (via drill 0.41)
  Top 0.254: IC9.60 90.33,50.32 85.31,45.31 v74.61,45.31
  Bottom 0.254: v74.61,45.31 R70.1
LED_READY  (via drill 0.41)
  Top 0.254: IC9.58 89.45,51.32 87.34,49.21 77.38,49.21 v74.61,51.66
  Bottom 0.254: v74.61,51.66 R68.1
LED_STATE  (via drill 0.41)
  Top 0.254: IC9.59 89.87,50.82 87.53,48.48 v74.61,48.48
  Bottom 0.254: v74.61,48.48 R69.1
N$1
  Bottom 0.254: 87.63,33.02 IC5.6 82.89,35.24
  Bottom 0.305: R41.2 87.63,33.02
  Bottom 0.406: 82.89,35.24 R40.1
N$2
  Bottom 0.254: 80.97,22.86 82.55,22.86 | 83.19,22.86 IC5.2
  Bottom 0.406: R29.1 80.97,22.86 | 82.55,22.86 82.87,22.54 R30.2 83.19,22.86
N$3  (via drill 0.41)
  Top 0.406: LED1.C 4.92,31.11 v3.81,31.11
  Bottom 0.406: R1.1 3.34,30.64 v3.81,31.11
N$4
  Top 1.676: U1.1 22.68,19.82 L1.B
N$5
  Top 0.254: C15.1 IC5.1 82.55,20.32 78.74,24.13 75.25,24.13 74.93,23.81 R34.2
  Bottom 0.254: 83.19,20.32 IC5.1
  Bottom 0.406: R30.1 83.19,20.32
N$6
  Top 0.254: IC5.3 87.66,22.86
  Top 0.406: 87.66,22.86 R32.2
  Bottom 0.254: 82.87,25.4 IC5.3
  Bottom 0.406: C14.2 82.87,25.4
N$7
  Top 0.254: C15.2 R32.1 89.85,23.82 89.53,24.13 88.27,24.13 87.95,24.45 R31.2
N$8
  Top 0.254: R35.2 75.25,25.4 IC5.12
  Bottom 0.254: 79.69,25.4 IC5.12
  Bottom 0.406: C16.1 79.69,25.4
N$9
  Top 0.254: R35.1 76.52,29.21 78.74,29.21 79.38,29.84 79.38,33.66 77.5,35.53 IC5.8 75.25,35.56 | 75.25,35.56 R37.2 arc-90 75.25,35.56
N$10
  Top 0.254: R37.1 75.25,33.02 IC5.9
  Bottom 0.254: R36.1 79.06,34.29 78.11,34.29 77.5,33.69 IC5.9
N$11
  Top 0.254: IC5.7 87.66,33.02
  Top 0.406: 87.66,33.02 C17.2
  Bottom 0.254: IC5.7 83.53,37.15 R40.2 R36.2
N$13
  Top 0.254: IC5.5 R39.2
  Bottom 0.254: 82.87,30.48 IC5.5
  Bottom 0.406: C18.1 82.87,30.48
N$14
  Top 0.254: R39.1 C17.1 89.85,33.98 89.53,34.29 88.27,34.29 87.95,34.61 R38.2
N$15
  Top 0.254: R34.1 73.98,20.64 73.66,20.95 73.66,29.21 74.93,30.48 IC5.10
  Bottom 0.254: IC5.10 80.01,30.48
  Bottom 0.305: 80.01,30.48 R33.2
N$16
  Bottom 0.254: OK2.4 140.01,15.24
  Bottom 0.406: 140.01,15.24 R13.2
N$17
  Bottom 0.254: OK2.1 133.66,19.37 135.57,19.37 136.2,18.73 136.2,16.51 R9.2
N$18
  Bottom 0.254: OK3.4 128.27,15.24
  Bottom 0.406: 128.27,15.24 R17.2
N$19
  Bottom 0.254: OK3.1 121.92,19.37 123.82,19.37 124.46,18.73 124.46,16.51 R15.2
N$20
  Bottom 0.254: 69.53,33.02 IC6.6 66.68,33.02 R53.1
  Bottom 0.305: R54.2 69.53,33.02
N$21
  Bottom 0.254: 65.09,22.86 IC6.2 | 64.45,22.86 63.18,22.86
  Bottom 0.406: 65.09,22.86 R43.2 64.45,22.86 | 63.18,22.86 62.86,22.54 R42.1
N$22
  Top 0.254: R47.2 56.83,23.81 57.15,24.13 60.64,24.13 64.45,20.32 IC6.1 C20.1
  Bottom 0.254: 65.09,20.32 IC6.1
  Bottom 0.406: R43.1 65.09,20.32
N$23
  Top 0.254: IC6.3 69.53,22.86
  Top 0.406: 69.53,22.86 R45.2
  Bottom 0.254: 64.77,25.4 IC6.3
  Bottom 0.406: C19.2 64.77,25.4
N$24
  Top 0.254: C20.2 R45.1 71.75,23.82 71.44,24.13 70.17,24.13 69.85,24.45 R44.2
  Top 0.406: R44.2
N$25
  Top 0.254: 57.15,25.4 IC6.12
  Top 0.406: R48.2 57.15,25.4
  Bottom 0.254: 61.59,25.4 IC6.12
  Bottom 0.406: C21.1 61.59,25.4
N$26
  Top 0.254: R48.1 58.42,29.21 60.64,29.21 61.28,29.84 61.28,33.66 IC6.8 56.83,35.56 R50.2
N$27
  Top 0.254: IC6.9 56.83,33.02
  Top 0.305: 56.83,33.02 R50.1
  Bottom 0.254: IC6.9 59.37,33.66 60.01,34.29 60.96,34.29 R49.1
  Bottom 0.406: R49.1
N$28
  Top 0.254: IC6.7 69.53,33.02 C22.2
  Bottom 0.254: IC6.7 65.41,37.15 R53.2 R49.2
N$29
  Top 0.254: IC6.5 R52.2
  Bottom 0.254: 64.77,30.48 IC6.5
  Bottom 0.406: C23.1 64.77,30.48
N$30
  Top 0.254: R51.2 69.85,34.61 70.17,34.29 71.44,34.29 71.75,33.98 C22.1 R52.1
  Top 0.406: R51.2
N$31
  Top 0.254: IC6.10 56.83,30.48 55.56,29.21 55.56,20.95 55.88,20.64 R47.1
  Bottom 0.254: 61.59,30.48 IC6.10
  Bottom 0.406: R46.2 61.59,30.48
N$32
  Bottom 0.254: 51.12,33.02 IC7.6 48.58,33.02 R66.1
  Bottom 0.406: R67.2 51.12,33.02
N$33
  Bottom 0.254: IC7.2 46.67,22.86 44.13,22.86
  Bottom 0.406: R56.2 46.67,22.86 | R55.1 44.13,22.86
N$34
  Top 0.254: R60.2 38.73,23.81 39.05,24.13 42.55,24.13 46.35,20.32 IC7.1 C25.1
  Bottom 0.254: 46.67,20.32 IC7.1
  Bottom 0.406: R56.1 46.67,20.32
N$35
  Top 0.254: IC7.3 49.22,25.4 R58.2
  Bottom 0.254: 46.67,25.4 IC7.3
  Bottom 0.406: C24.2 46.67,25.4
N$36
  Top 0.254: C25.2 R58.1 | R58.1 53.66,23.81 53.34,24.13 52.07,24.13 51.75,24.45 R57.2
  Top 0.406: R58.1 | R57.2
N$37
  Top 0.254: IC7.12 38.73,25.4
  Top 0.305: 38.73,25.4 R61.2
  Bottom 0.254: 43.49,25.4 IC7.12
  Bottom 0.406: C26.1 43.49,25.4
N$38
  Top 0.254: R61.1 38.73,27.94 40.01,29.21 42.55,29.21 43.18,29.84 43.18,33.66 IC7.8 39.05,35.56
  Top 0.406: R63.2 39.05,35.56
N$39
  Top 0.254: 39.05,33.02 IC7.9
  Top 0.406: R63.1 39.05,33.02
  Bottom 0.254: R62.1 42.87,34.29 41.91,34.29 41.27,33.66 IC7.9
N$40
  Top 0.254: C27.2 IC7.7
  Bottom 0.254: R62.2 R66.2 | R66.2 47.31,37.15 IC7.7
  Bottom 0.406: R66.2
N$41
  Top 0.254: R65.2 IC7.5
  Bottom 0.254: 46.67,30.48 IC7.5
  Bottom 0.406: C28.1 46.67,30.48
N$42
  Top 0.254: R65.1 C27.1 R64.2
N$43
  Top 0.254: R60.1 37.78,20.64 37.47,20.95 37.47,28.89 39.05,30.48 IC7.10
  Top 0.406: R60.1
  Bottom 0.254: 43.49,30.48 IC7.10
  Bottom 0.406: R59.2 43.49,30.48
N$45  (via drill 0.41)
  Top 0.254: v67.63,51.66 LED6.A
  Bottom 0.254: R68.2 v67.63,51.66
N$47  (via drill 0.41)
  Top 0.254: v67.63,48.48 LED7.A
  Bottom 0.254: R69.2 v67.63,48.48
N$48  (via drill 0.41)
  Top 0.254: v67.63,45.31 LED8.A
  Bottom 0.254: R70.2 v67.63,45.31
N$50  (via drill 0.41)
  Top 0.305: IC8.4 59.37,49.59 v58.47,50.49
  Bottom 0.305: C30.2 57.89,50.48 v58.47,50.49
N$51  (via drill 0.41)
  Top 0.305: IC8.2 58.06,48.18 v58.47,48.59
  Bottom 0.305: C30.1 57.88,48.58 v58.47,48.59
N$52  (via drill 0.41)
  Top 0.305: IC8.6 60.66,48.39 arc-90 v60.84,48.59
  Bottom 0.305: 62.23,48.26 61.9,48.59 v60.84,48.59
  Bottom 0.406: C29.2 62.23,48.26
N$53  (via drill 0.41)
  Top 0.305: IC8.5 60.01,49.74 v60.84,50.48
  Bottom 0.305: v60.84,50.48 60.98,50.48 C29.1
  Bottom 0.406: C29.1 62.23,50.8
N$54
  Top 0.305: IC8.3 58.72,45.06 58.42,44.77 54.29,44.77 52.7,46.35 C31.1
N$55
  Top 0.406: IC8.7 61.31,47.34 62.55,48.58 C32.1
N$56
  Bottom 0.254: R79.2 130.04,2.86 84.13,2.86 82.86,4.13 OK4.3 82.86,8.89 C43.1
N$58  (via drill 0.41)
  Top 0.406: LED2.C 4.92,37.47 v3.81,37.47
  Bottom 0.305: v3.81,37.47 v3.81,37.46 R2.1
N$65  (via drill 0.41)
  Top 0.406: LED4.C 4.92,40.64 v3.81,40.64
  Bottom 0.305: v3.81,40.64 R4.1
N$67
  Bottom 0.254: R71.1 R72.1 C34.2
N$69
  Bottom 0.254: R81.2 30.48,22.54 28.89,20.95 28.89,16.19 27.62,14.93 Q4.1
N$70
  Bottom 0.254: R84.2 127.44,3.49 88.9,3.49 87.94,4.45 OK4.5 87.94,8.57
  Bottom 0.406: 87.94,8.57 C44.1
N$71
  Bottom 0.254: 123.82,5.08 122.87,4.13 93.98,4.13 93.02,5.08 OK4.7 93.02,8.89 C45.1
  Bottom 0.406: 123.82,5.08 R89.2
N$72
  Bottom 0.254: R74.2 132.53,2.22 79.69,2.22 77.78,4.13 OK4.1 77.78,8.57
  Bottom 0.406: 77.78,8.57 C42.1
N$73
  Bottom 0.254: OK1.4 151.76,15.56
  Bottom 0.406: 151.76,15.56 R12.2
N$74
  Bottom 0.254: R8.2 147.95,16.51 147.95,18.73 147.32,19.37 145.41,19.37 OK1.1
N$75  (via drill 0.41)
  Top 0.406: LED5.C 4.92,43.81 v3.81,43.81
  Bottom 0.305: v3.81,43.81 R5.1
N$76  (via drill 0.41)
  Top 0.406: LED3.A 4.92,34.29 v3.81,34.29
  Bottom 0.305: v3.81,34.29 R3.1
OSC1I
  Top 0.254: 101.28,61.91 100.2,61.91 98.54,60.25 IC9.39 | 101.28,61.91 Q1.2 | C38.2 101.28,61.91
OSC1O
  Top 0.254: IC9.40 98.04,60.39 96.52,61.91 95.57,61.91 C41.2
  Top 0.406: 95.57,61.91 Q1.1
PGEC
  Top 0.254: ICSP.5 83.5,65.41 83.5,63.82 84.14,63.18 87,63.18 87.63,62.55 87.63,58.1 88.65,57.17 95.76,57.17 96.04,56.9 IC9.44
PGED
  Top 0.254: IC9.43 96.54,57.13 95.89,57.78 88.9,57.78 88.27,58.42 88.27,63.18 87,64.45 ICSP.4
RO1  (via drill 0.41)
  Top 0.254: v52.07,43.5 84.45,43.5 90.78,49.82 IC9.61
  Bottom 0.254: v52.07,43.5 44.77,43.5 34.92,33.65 R81.1
RO1_COM_CON
  Bottom 0.61: K1.3 34.09,14.92 34.09,9.84 READY.2
RO1_NC_CON
  Bottom 0.61: K1.2 35.17,13.89 35.17,6.03 READY.3
RO1_NO_CON
  Bottom 0.61: K1.4 33.02,16.19 33.02,10.79 31.11,8.89 27.94,8.89 24.84,5.79 READY.1
RS232_RX
  Top 0.254: IC8.8 61.97,44.82 61.28,44.13 53.02,44.13 50.8,46.35 50.8,53.34 55.88,58.42 55.88,64.77 57.15,66.04 64.77,66.04 66.61,64.2 RS-232.2
RS232_TX
  Top 0.254: RS-232.3 63.87,59.74 59.37,55.24 59.37,53.16
  Top 0.305: 59.37,53.16 IC8.13
UART_RX
  Top 0.254: IC8.9 62.47,53.66 83.19,53.66 84.02,52.82 IC9.55
  Top 0.305: 62.01,53.2 arc90 IC8.9
UART_TX
  Top 0.254: IC8.11 60.66,54 60.96,54.29 83.5,54.29 84.48,53.31 IC9.54

## Text on the board
Top: v1.0.0 rev.1
tNames: READY | STATE | ERROR | 3V3 | 5V | +12V | -12V | 24V | 3A | +24V | GND | NO | COM | NC